# EAGLE schematic CaliperGaugeV0.4 (EAGLE 7.7.0)

## Sheet 1 of 2
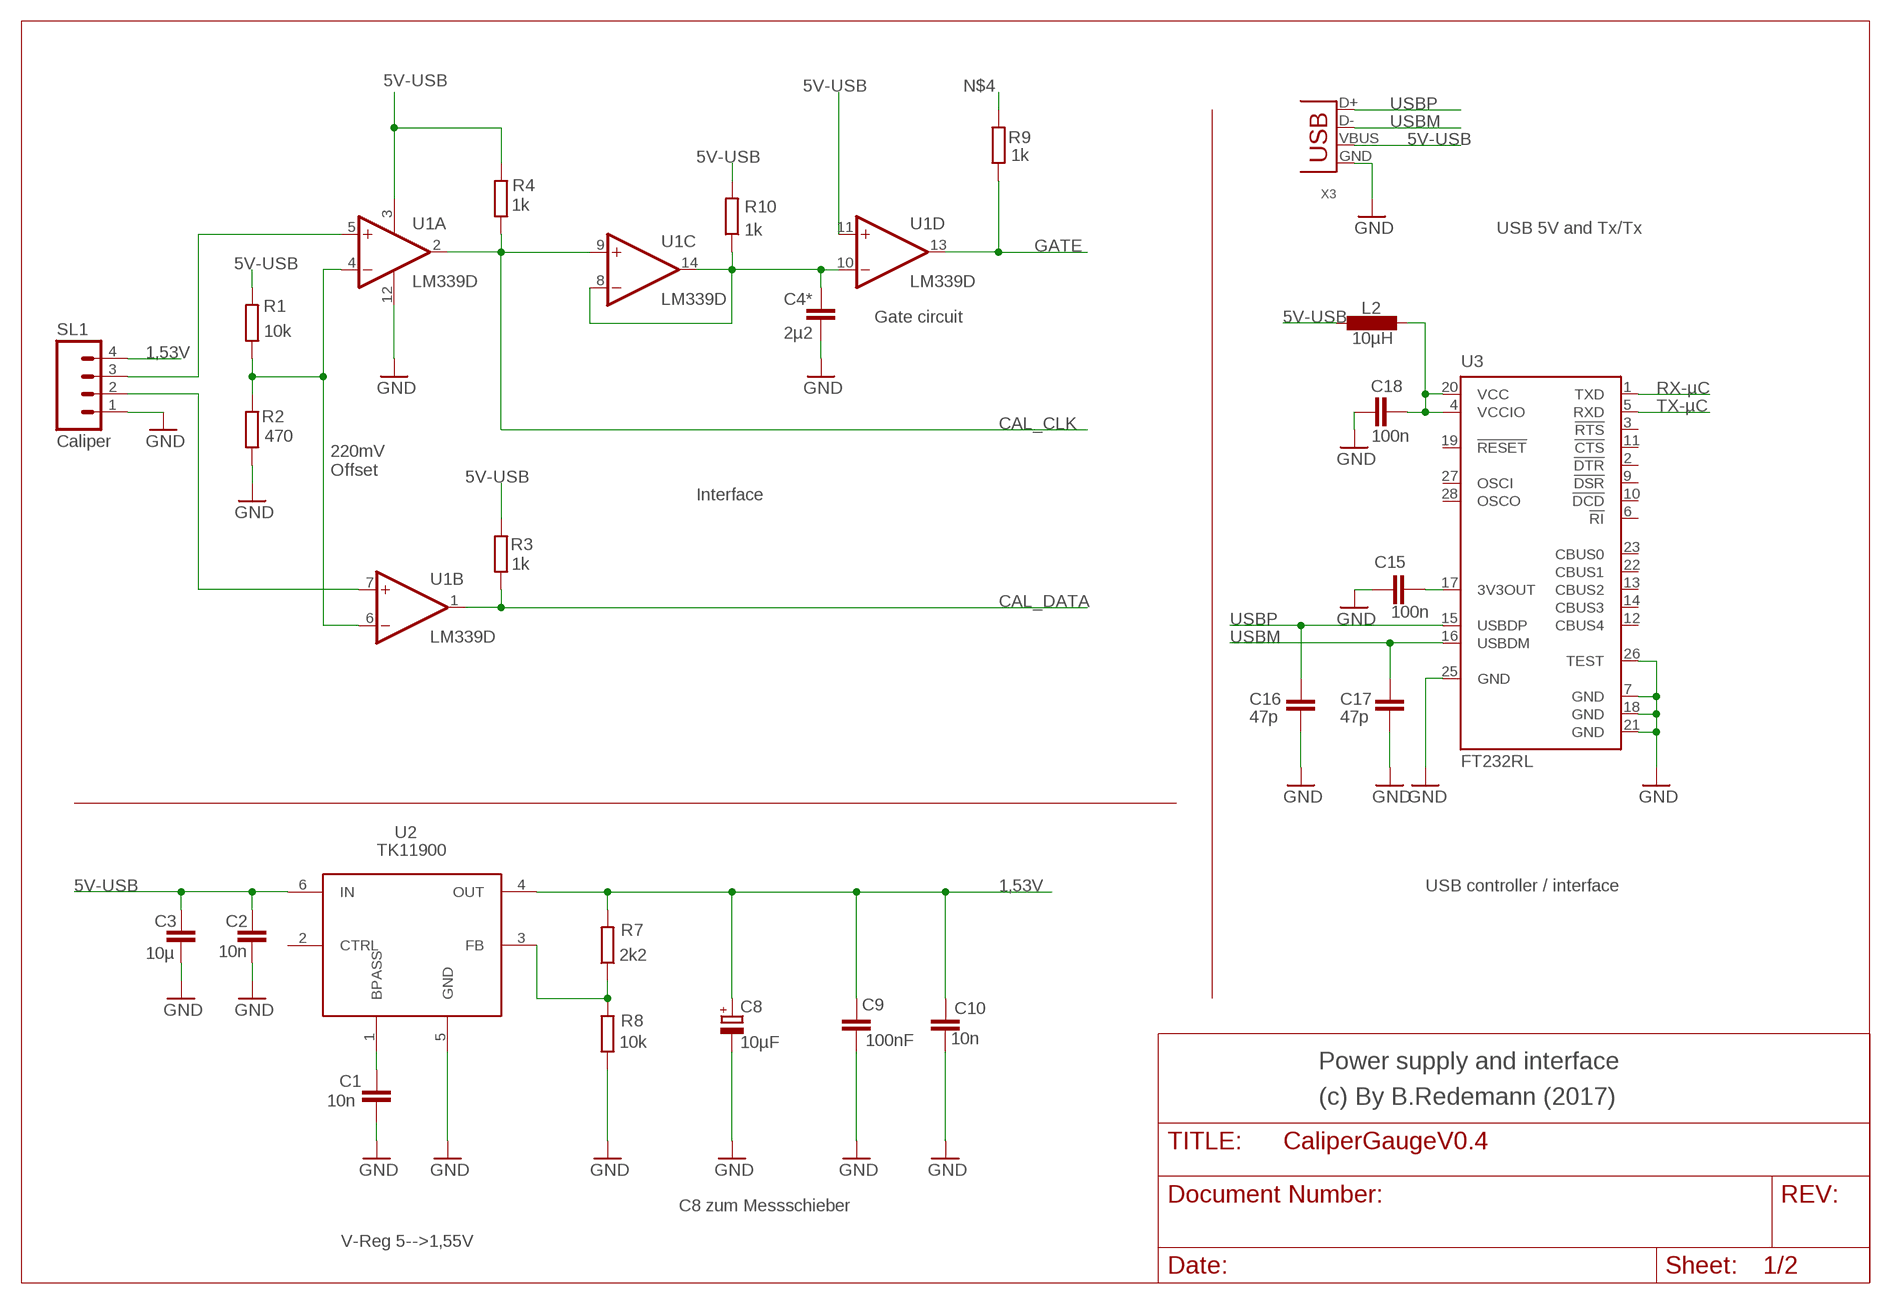
[diagram p0: schematic, sheet 1]

### Parts
C1  10n  C-EUC0805  [C0805]
C2  10n  C-EUC0805  [C0805]
C3  10µ  C-EUC0805  [C0805]
C4*  2µ2  C-EUC0805  [C0805]
C8  10µF  CPOL-EU153CLV-0405  [153CLV-0405]
C9  100nF  C-EUC0805  [C0805]
C10  10n  C-EUC0805  [C0805]
C15  100n  C-EUC0805  [C0805]
C16  47p  C-EUC0805  [C0805]
C17  47p  C-EUC0805  [C0805]
C18  100n  C-EUC0805  [C0805]
L2  10µH  L-EUL2825P  [L2825P]
R1  10k  R-EU_M0805  [M0805]
R2  470  R-EU_M0805  [M0805]
R3  1k  R-EU_M0805  [M0805]
R4  1k  R-EU_M0805  [M0805]
R7  2k2  R-EU_M0805  [M0805]
R8  10k  R-EU_M0805  [M0805]
R9  1k  R-EU_M0805  [M0805]
R10  1k  R-EU_M0805  [M0805]
SL1  Caliper  M04  [04P]
U1  LM339D  [SO14]
U2  TK11900  [SOT23-6]
U3  FT232RL  [SSOP28]
X3  USB  USB-B180  [USB-B180]

### Nets
1,53V: C8.+ C9.2 C10.2 R7.2 SL1.4 U2.4(OUT)
5V-USB: C2.2 C3.2 L2.2 R1.2 R3.2 R4.2 R10.2 U1.3(P:V+) U1.11(D:+IN) U2.6(IN) X3.VBUS ; also sheet 2
CAL_CLK: R4.1 U1.2(A:OUT) U1.9(C:+IN) ; also sheet 2
CAL_DATA: R3.1 U1.1(B:OUT) ; also sheet 2
GATE: R9.1 U1.13(D:OUT) ; also sheet 2
GND: C1.1 C2.1 C3.1 C4*.1 C8.- C9.1 C10.1 C15.1 C16.1 C17.1 C18.1 R2.1 R8.1 SL1.1 U1.12(P:GND) U2.5(GND) U3.7(GND) U3.18(GND) U3.21(GND) U3.25(GND) U3.26(TEST) X3.GND ; also sheet 2
N$1: C1.2 U2.1(BPASS)
N$2: R7.1 R8.2 U2.3(FB)
N$3: R1.1 R2.2 U1.4(A:-IN) U1.6(B:-IN)
N$4: R9.2
N$10: SL1.2 U1.7(B:+IN)
N$11: SL1.3 U1.5(A:+IN)
N$12: C15.2 U3.17(3V3OUT)
N$15: C4*.2 R10.1 U1.8(C:-IN) U1.10(D:-IN) U1.14(C:OUT)
N$16: C18.2 L2.1 U3.4(VCCIO) U3.20(VCC)
RX-µC: U3.1(TXD) ; also sheet 2
TX-µC: U3.5(RXD) ; also sheet 2
USBM: C17.2 U3.16(USBDM) X3.D-
USBP: C16.2 U3.15(USBDP) X3.D+
Unconnected: U2.2(CTRL) U3.2(!DTR) U3.3(!RTS) U3.6(!RI) U3.9(!DSR) U3.10(!DCD) U3.11(!CTS) U3.12(CBUS4) U3.13(CBUS2) U3.14(CBUS3) U3.19(!RESET) U3.22(CBUS1) U3.23(CBUS0) U3.27(OSCI) U3.28(OSCO)

### Notes on the sheet
- USB 5V and Tx/Tx
- Gate circuit
- 220mV
  Offset
- Interface
- USB controller / interface
- Power supply and interface
- (c) By B.Redemann (2017)
- C8 zum Messschieber
- V-Reg 5-->1,55V

## Sheet 2 of 2
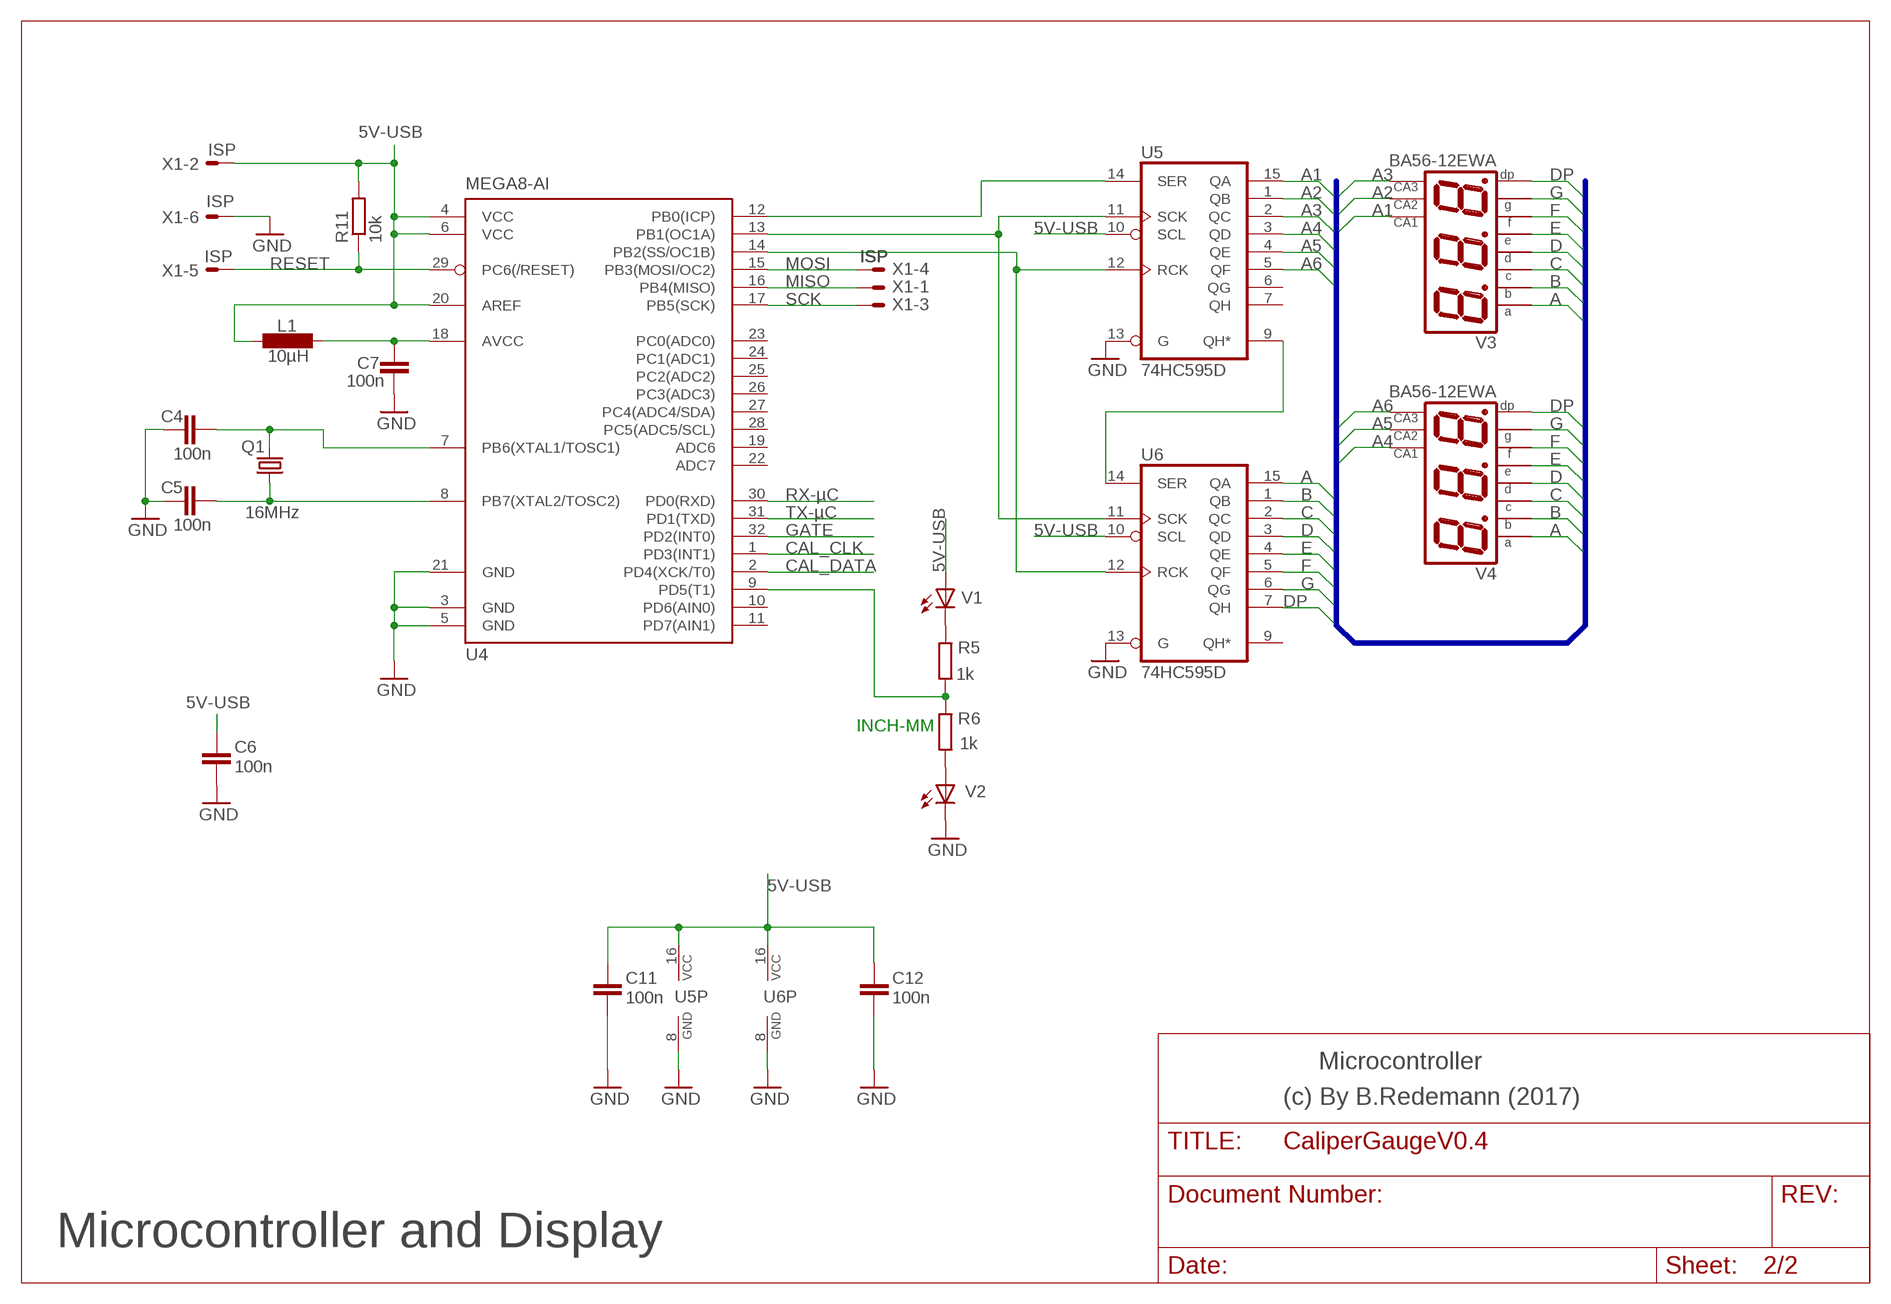
[diagram p1: schematic, sheet 2]

### Parts
C4  100n  C-EUC0805  [C0805]
C5  100n  C-EUC0805  [C0805]
C6  100n  C-EUC0805  [C0805]
C7  100n  C-EUC0805  [C0805]
C11  100n  C-EUC0805  [C0805]
C12  100n  C-EUC0805  [C0805]
L1  10µH  L-EUL2825P  [L2825P]
Q1  16MHz  CRYSTALHC49UP  [HC49UP]
R5  1k  R-EU_R0805  [R0805]
R6  1k  R-EU_R0805  [R0805]
R11  10k  R-EU_R0805  [R0805]
U4  MEGA8-AI  [TQFP32-08]
U5  74HC595D  [SO16]
U6  74HC595D  [SO16]
V1  LEDCHIPLED_0805  [CHIPLED_0805]
V2  LEDCHIPLED_0805  [CHIPLED_0805]
V3  BA56-12EWA  [BX56-12]
V4  BA56-12EWA  [BX56-12]
X1  ISP  ML6E  [ML6]

### Nets
5V-USB: C6.2 C11.2 C12.2 L1.2 R11.2 U4.4(VCC) U4.6(VCC) U4.20(AREF) U5.10(SCL) U5.16(VCC) V1.A X1.2 ; also sheet 1
A: U6.15(QA) V3.11(A) V4.11(A)
A1: U5.15(QA) V3.12(CA)
A2: U5.1(QB) V3.9(CA)
A3: U5.2(QC) V3.8(CA)
A4: U5.3(QD) V4.12(CA)
A5: U5.4(QE) V4.9(CA)
A6: U5.5(QF) V4.8(CA)
B: U6.1(QB) V3.7(B) V4.7(B)
C: U6.2(QC) V3.4(C) V4.4(C)
CAL_CLK: U4.1(PD3(INT1)) ; also sheet 1
CAL_DATA: U4.2(PD4(XCK/T0)) ; also sheet 1
D: U6.3(QD) V3.2(D) V4.2(D)
DP: U6.7(QH) V3.3(DP) V4.3(DP)
E: U6.4(QE) V3.1(E) V4.1(E)
F: U6.5(QF) V3.10(F) V4.10(F)
G: U6.6(QG) V3.5(G) V4.5(G)
GATE: U4.32(PD2(INT0)) ; also sheet 1
GND: C4.1 C5.1 C6.1 C7.1 C11.1 C12.1 U4.3(GND) U4.5(GND) U4.21(GND) U5.8(GND) U5.13(G) U6.8(GND) U6.13(G) V2.C X1.6 ; also sheet 1
MISO: U4.16(PB4(MISO)) X1.1
MOSI: U4.15(PB3(MOSI/OC2)) X1.4
N$5: U4.13(PB1(OC1A)) U5.11(SCK) U6.11(SCK)
N$6: U4.14(PB2(SS/OC1B)) U5.12(RCK) U6.12(RCK)
N$7: R5.2 R6.1 U4.9(PD5(T1))
N$8: C4.2 Q1.2 U4.7(PB6(XTAL1/TOSC1))
N$9: C5.2 Q1.1 U4.8(PB7(XTAL2/TOSC2))
N$13: C7.2 L1.1 U4.18(AVCC)
N$14: U4.12(PB0(ICP)) U5.14(SER)
N$17: U5.9(QH*) U6.14(SER)
N$18: R6.2 V2.A
N$19: R5.1 V1.C
RESET: R11.1 U4.29(PC6(/RESET)) X1.5
RX-µC: U4.30(PD0(RXD)) ; also sheet 1
SCK: U4.17(PB5(SCK)) X1.3
TX-µC: U4.31(PD1(TXD)) ; also sheet 1
Unconnected: U4.10(PD6(AIN0)) U4.11(PD7(AIN1)) U4.19(ADC6) U4.22(ADC7) U4.23(PC0(ADC0)) U4.24(PC1(ADC1)) U4.25(PC2(ADC2)) U4.26(PC3(ADC3)) U4.27(PC4(ADC4/SDA)) U4.28(PC5(ADC5/SCL)) U5.6(QG) U5.7(QH) U6.9(QH*) U6.10(SCL)

### Buses
A,B,C,D,E,F,G,DP,A1,A2,A3,A4,A5,A6

### Notes on the sheet
- INCH-MM
- Microcontroller
- (c) By B.Redemann (2017)
- Microcontroller and Display

## Power pins joined to a net without a drawn wire
VCC: U6.16(VCC)

## Library data of the parts
C1-C4 C4* C5-C7 C9-C12 C15-C18 = rcl:C-EU: CAPACITOR, European symbol
C8 = rcl:CPOL-EU: POLARIZED CAPACITOR, European symbol
L1 L2 = rcl:L-EU: INDUCTOR, European symbol
Q1 = crystal:CRYSTAL: CRYSTAL; OC_FARNELL: unknown; OC_NEWARK: unknown
R1-R11 = rcl:R-EU_: RESISTOR, European symbol
SL1 = con-amp-quick:M04: AMP QUICK CONNECTOR; OC_FARNELL: unknown; OC_NEWARK: unknown
U1 = linear:LM339: Low Power Low Offset Voltage Quad Comparators with open collector; LM139/LM239/LM339/LM2901/LM3302
U2 = toko:TK11900
U3 = ftdichip:FT232R: Source: http://www.ftdichip.com/Documents/DataSheets/DS_FT232R_v104.pdf; MPN: FT232RL; OC_FARNELL: 1146032; OC_NEWARK: 91K9918
U4 = atmel:MEGA8: MICROCONTROLLER 8 Kbytes FLASH, 1 kbytes SRAM, 512 bytes EEPROM, USART, 6-channel 10 bit ADC, 2-channel 8 bit ADC Pin compatible with Atmega48, ATMega88, ATMega168 Source: avr.lbr; MPN: ATMEGA8-16AU; OC_FARNELL: 9171371; OC_NEWARK: 73M8863
U5 U6 = 74xx-eu:74*595: 8-bit SHIFT REGISTER, output latch
V1 V2 = led:LED: LED OSRAM: - CHIPLED LG R971, LG N971, LY N971, LG Q971, LY Q971, LO R971, LY R971 LH N974, LH R974 LS Q976, LO Q976, LY Q976 LO Q996 - Hyper CHIPLED LW Q18S LB Q993, LB Q99A, LB R99A - SideLED LS A670, LO A670, LY A670, LG A670, LP A670 LB A673, LV A673, LT A673, LW A673 LH A674 LY A675 LS A676, LA A676, LO A676, LY A676, LW A676 LS A679, LY A679, LG A679 - Hyper Micro SIDELED® LS Y876, LA Y876, LO Y876, LY Y876 LT Y87S - SmartLED LW L88C, LW L88S LB L89C, LB L89S, LG L890 LS L89K, LO L89K, LY L89K LS L896, LA L896, LO L896, LY L896 - TOPLED LS T670, LO T670, LY T670, LG T670, LP T670 LSG T670, LSP T670, LSY T670, LOP T670, LYG T670 LG T671, LOG T671, LSG T671 LB T673, LV T673, LT T673, LW T673 LH T674 LS T676, LA T676, LO T676, LY T676, LB T676, LH T676, LSB T676, LW T676 LB T67C, LV T67C, LT T67C, LS T67K, LO T67K, LY T67K, LW E67C LS E67B, LA E67B, LO E67B, LY E67B, LB E67C, LV E67C, LT E67C LW T67C LS T679, LY T679, LG T679 LS T770, LO T770, LY T770, LG T770, LP T770 LB T773, LV T773, LT T773, LW T773 LH T774 LS E675, LA E675, LY E675, LS T675 LS T776, LA T776, LO T776, LY T776, LB T776 LHGB T686 LT T68C, LB T68C - Hyper Mini TOPLED® LB M676 - Mini TOPLED Santana® LG M470 LS M47K, LO M47K, LY M47K Source: http://www.osram.convergy.de LUXEON: - LUMILED® LXK2-PW12-R00, LXK2-PW12-S00, LXK2-PW14-U00, LXK2-PW14-V00 LXK2-PM12-R00, LXK2-PM12-S00, LXK2-PM14-U00 LXK2-PE12-Q00, LXK2-PE12-R00, LXK2-PE12-S00, LXK2-PE14-T00, LXK2-PE14-U00 LXK2-PB12-K00, LXK2-PB12-L00, LXK2-PB12-M00, LXK2-PB14-N00, LXK2-PB14-P00, LXK2-PB14-Q00 LXK2-PR12-L00, LXK2-PR12-M00, LXK2-PR14-Q00, LXK2-PR14-R00 LXK2-PD12-Q00, LXK2-PD12-R00, LXK2-PD12-S00 LXK2-PH12-R00, LXK2-PH12-S00 LXK2-PL12-P00, LXK2-PL12-Q00, LXK2-PL12-R00 Source: www.luxeon.com KINGBRIGHT: KA-3528ASYC Source: www.kingbright.com
V3 V4 = display-kingbright:B?56-12*WA: 14.22mm (0.56INCH) THREE DIGIT NUMERIC DISPLAY Source: http://www.kingbright.com .. BA56-11EWA(Ver1189474895.pdf; OC_FARNELL: unknown; OC_NEWARK: unknown
X1 = con-harting-ml:ML6?E: HARTING; OC_FARNELL: unknown; OC_NEWARK: unknown
X3 = con-usb-3:USB: USB Connectors